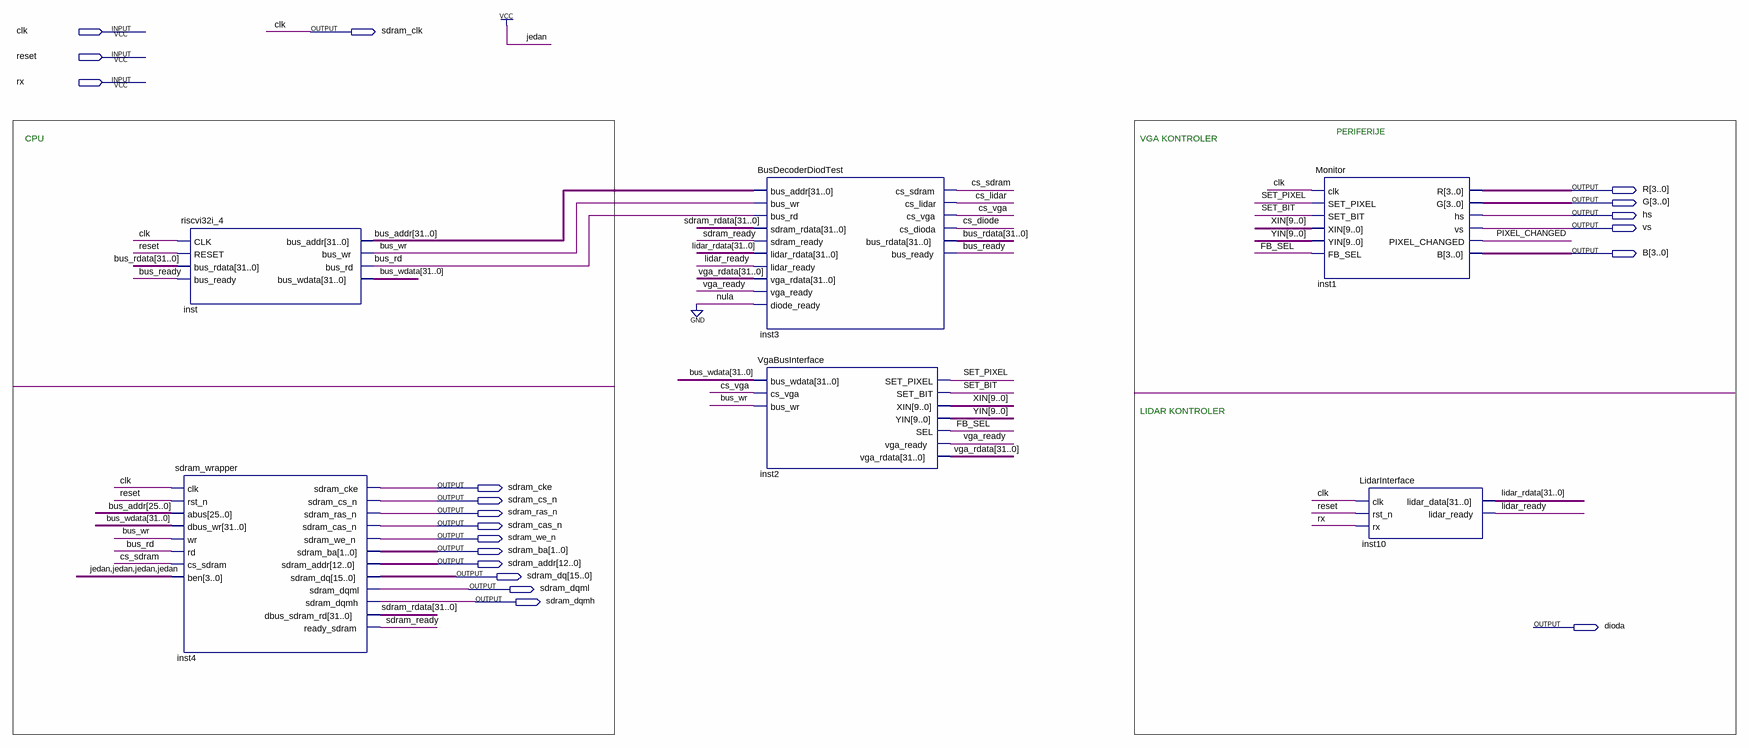
[diagram p0: schematic sheet]
// Quartus schematic DiodeTest.bdf as structural Verilog: 6 symbols, 20 pins
module DiodeTest (
  input  clk,
  input  reset,
  input  rx,
  output sdram_clk,
  output [3:0] R,
  output [3:0] G,
  output hs,
  output vs,
  output [3:0] B,
  output sdram_cke,
  output sdram_cs_n,
  output sdram_ras_n,
  output sdram_cas_n,
  output sdram_we_n,
  output [1:0] sdram_ba,
  output [12:0] sdram_addr,
  output [15:0] sdram_dq,
  output sdram_dqml,
  output sdram_dqmh,
  output dioda
);

  wire bus_rd, bus_ready, bus_wr, cs_diode, cs_lidar, cs_sdram, cs_vga, FB_SEL, lidar_ready, PIXEL_CHANGED,
       sdram_ready, SET_BIT, SET_PIXEL, vga_ready;
  wire [9:0] XIN, YIN;
  wire [31:0] bus_addr, bus_rdata, bus_wdata, lidar_rdata, sdram_rdata, vga_rdata;

  riscvi32i_4 inst (
    .CLK(clk), .RESET(reset), .bus_rdata(bus_rdata), .bus_ready(bus_ready), .bus_addr(bus_addr),
    .bus_wr(bus_wr), .bus_rd(bus_rd), .bus_wdata(bus_wdata));
  sdram_wrapper inst4 (
    .clk(clk), .rst_n(reset), .abus(bus_addr[25:0]), .dbus_wr(bus_wdata), .wr(bus_wr), .rd(bus_rd),
    .cs_sdram(cs_sdram), .ben(4'b1111), .sdram_cke(sdram_cke), .sdram_cs_n(sdram_cs_n),
    .sdram_ras_n(sdram_ras_n), .sdram_cas_n(sdram_cas_n), .sdram_we_n(sdram_we_n), .sdram_ba(sdram_ba),
    .sdram_addr(sdram_addr), .sdram_dqml(sdram_dqml), .sdram_dqmh(sdram_dqmh), .dbus_sdram_rd(sdram_rdata),
    .ready_sdram(sdram_ready), .sdram_dq(sdram_dq));
  BusDecoderDiodTest inst3 (
    .bus_addr(bus_addr), .bus_wr(bus_wr), .bus_rd(bus_rd), .sdram_rdata(sdram_rdata),
    .sdram_ready(sdram_ready), .lidar_rdata(lidar_rdata), .lidar_ready(lidar_ready), .vga_rdata(vga_rdata),
    .vga_ready(vga_ready), .diode_ready(1'b0), .cs_sdram(cs_sdram), .cs_lidar(cs_lidar), .cs_vga(cs_vga),
    .cs_dioda(cs_diode), .bus_rdata(bus_rdata), .bus_ready(bus_ready));
  VgaBusInterface inst2 (
    .bus_wdata(bus_wdata), .cs_vga(cs_vga), .bus_wr(bus_wr), .SET_PIXEL(SET_PIXEL), .SET_BIT(SET_BIT),
    .XIN(XIN), .YIN(YIN), .SEL(FB_SEL), .vga_ready(vga_ready), .vga_rdata(vga_rdata));
  Monitor inst1 (
    .clk(clk), .SET_PIXEL(SET_PIXEL), .SET_BIT(SET_BIT), .XIN(XIN), .YIN(YIN), .FB_SEL(FB_SEL), .R(R), .G(G),
    .hs(hs), .vs(vs), .PIXEL_CHANGED(PIXEL_CHANGED), .B(B));
  LidarInterface inst10 (.clk(clk), .rst_n(reset), .rx(rx), .lidar_data(lidar_rdata), .lidar_ready(lidar_ready));

  assign sdram_clk = clk;

  // Notes on the sheet:
  //   PERIFERIJE
  //   CPU
  //   VGA KONTROLER
  //   LIDAR KONTROLER
endmodule
